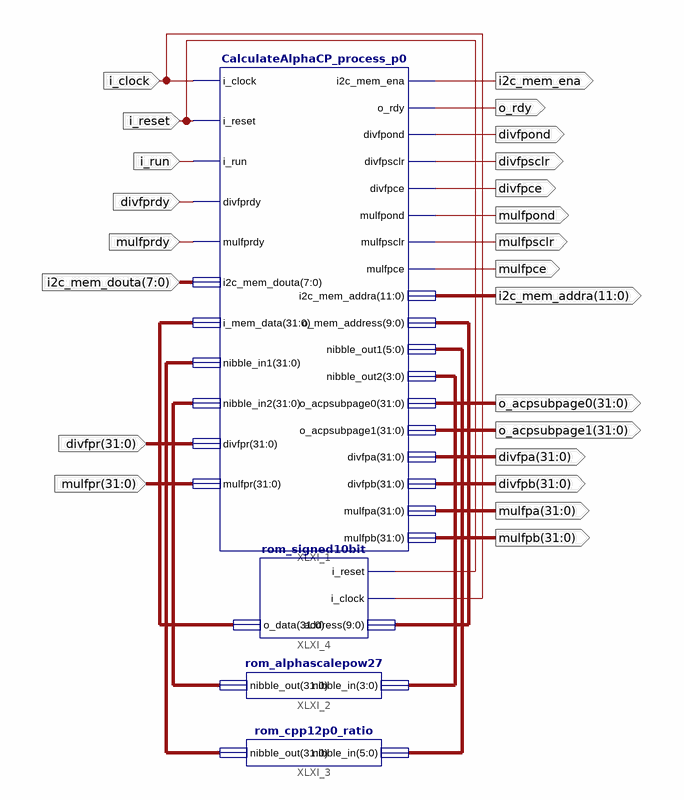
[diagram p0: schematic sheet 1]
// Xilinx ISE schematic CalculateAlphaCP.sch (virtex4) as structural Verilog: 4 symbols, 23 ports
module CalculateAlphaCP (
  input  i_clock,
  input  i_reset,
  input  i_run,
  input  divfprdy,
  input  mulfprdy,
  input  [7:0] i2c_mem_douta,
  input  [31:0] divfpr,
  input  [31:0] mulfpr,
  output i2c_mem_ena,
  output o_rdy,
  output divfpond,
  output divfpsclr,
  output divfpce,
  output mulfpond,
  output mulfpsclr,
  output mulfpce,
  output [11:0] i2c_mem_addra,
  output [31:0] o_acpsubpage0,
  output [31:0] o_acpsubpage1,
  output [31:0] divfpa,
  output [31:0] divfpb,
  output [31:0] mulfpa,
  output [31:0] mulfpb
);

  wire [3:0] XLXN_3;
  wire [5:0] XLXN_4;
  wire [9:0] XLXN_7;
  wire [31:0] XLXN_1, XLXN_2, XLXN_6;

  CalculateAlphaCP_process_p0 XLXI_1 (
    .i_clock(i_clock), .i_reset(i_reset), .i_run(i_run), .divfprdy(divfprdy), .mulfprdy(mulfprdy),
    .i2c_mem_douta(i2c_mem_douta), .i_mem_data(XLXN_6), .nibble_in1(XLXN_2), .nibble_in2(XLXN_1),
    .divfpr(divfpr), .mulfpr(mulfpr), .i2c_mem_ena(i2c_mem_ena), .o_rdy(o_rdy), .divfpond(divfpond),
    .divfpsclr(divfpsclr), .divfpce(divfpce), .mulfpond(mulfpond), .mulfpsclr(mulfpsclr), .mulfpce(mulfpce),
    .i2c_mem_addra(i2c_mem_addra), .o_mem_address(XLXN_7), .nibble_out1(XLXN_4), .nibble_out2(XLXN_3),
    .o_acpsubpage0(o_acpsubpage0), .o_acpsubpage1(o_acpsubpage1), .divfpa(divfpa), .divfpb(divfpb),
    .mulfpa(mulfpa), .mulfpb(mulfpb));
  rom_alphascalepow27 XLXI_2 (.nibble_in(XLXN_3), .nibble_out(XLXN_1));
  rom_cpp12p0_ratio XLXI_3 (.nibble_in(XLXN_4), .nibble_out(XLXN_2));
  rom_signed10bit XLXI_4 (.address(XLXN_7), .i_clock(i_clock), .i_reset(i_reset), .o_data(XLXN_6));
endmodule
